# Altium project PCB_Project2.PrjPCB
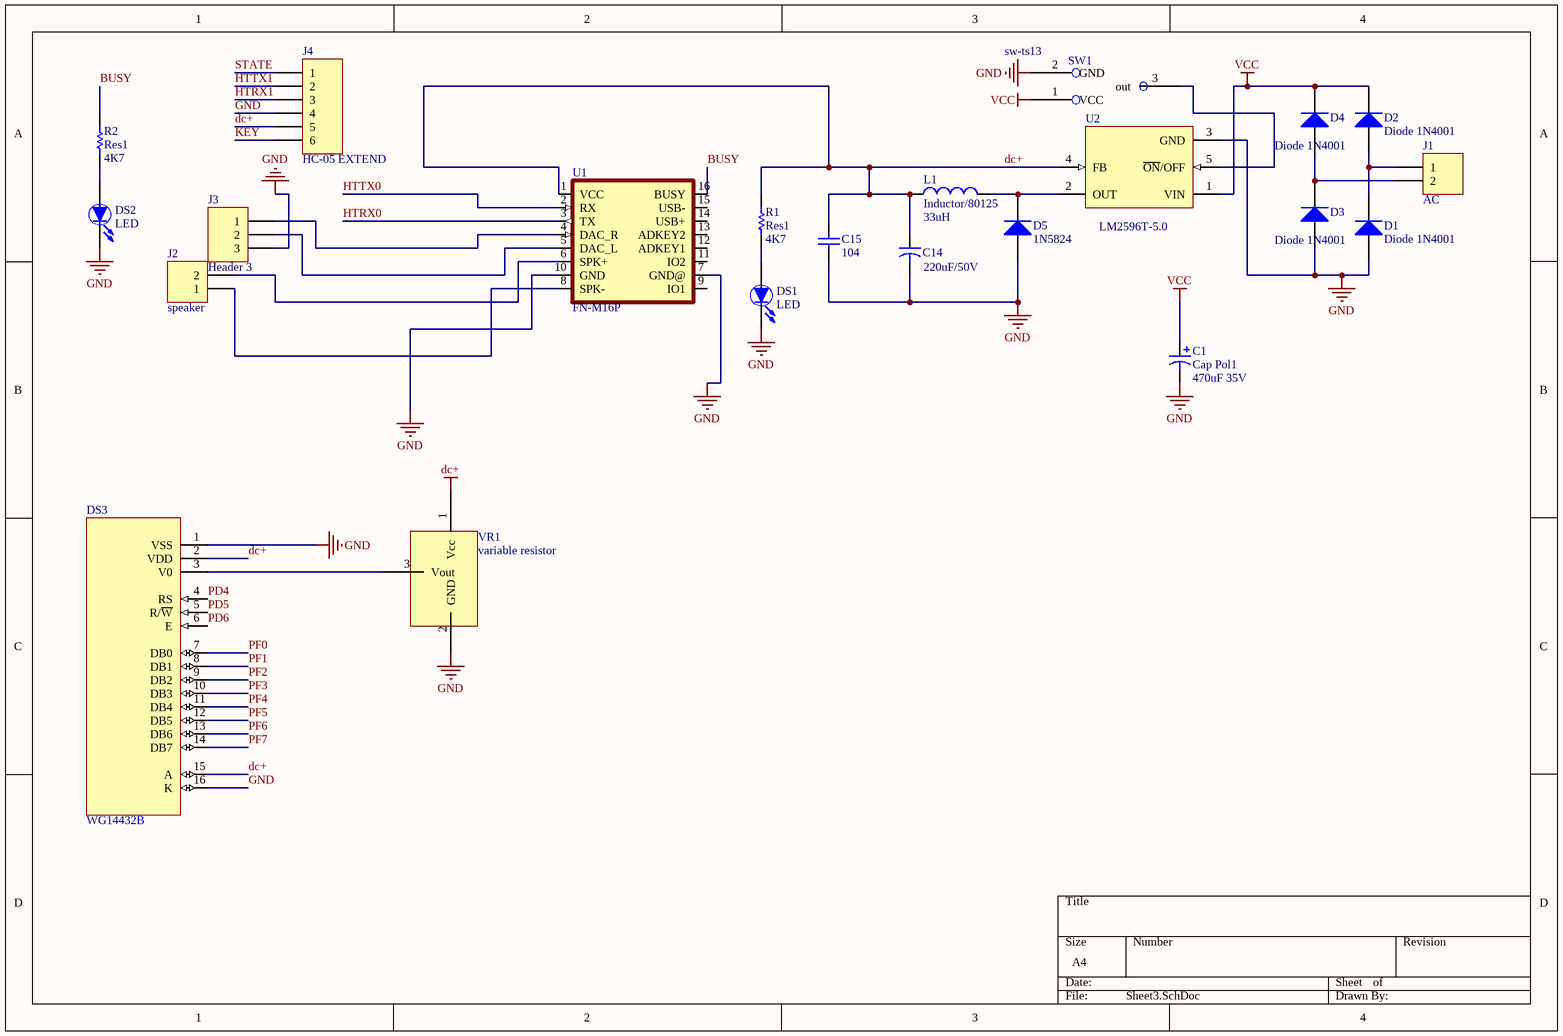
[diagram p0: Sheet3.SchDoc]
2 sheets, 40 parts. Net scope: global (net labels, ports and power ports of the same name join across sheets).
Board file: PCB1.PcbDoc
Sheets:
  Sheet3.SchDoc
  Sheet4.SchDoc

## Sheet Sheet3.SchDoc
size A4

### Parts
(Parts that share a designator on the sheet are numbered #1, #2 ... from top to bottom, then left to right.)
C1#1  Cap Pol1  value 470uF 35V  [RB7.6-15]
C14  value 220uF/50V  [CAPR5-4X5]  (hidden comment: Cap2)
C15  104  [C200]
D1  Diode 1N4001  [DO-41]
D2  Diode 1N4001  [DO-41]
D3  Diode 1N4001  [DO-41]
D4  Diode 1N4001  [DO-41]
D5  1N5824  [DO-201AD]
DS1  LED  [LED-3mm_G]
DS2  LED  [LED-3mm_G]
DS3  WG14432B  [LCM_16]
J1  AC  [HDR1X2]
J2  speaker  [HDR1X2]
J3  Header 3  [HDR1X3]
J4  HC-05 EXTEND  [HDR1X6]
L1  Inductor/80125  value 33uH  [T080125]
R1  Res1  value 4K7  [AXIAL-0.3]
R2  Res1  value 4K7  [AXIAL-0.3]
SW1  sw-ts13  [TS-13]
U1  FN-M16P  [FN-M16P]
U2  LM2596T-5.0  [T05D]
VR1  variable resistor  [var_test]

### Nets
dc+: C14.1 C15.2 DS3.2(VDD) DS3.15(A) J4.5 L1.1 R1.2 U1.1(VCC) U2.4(FB) VR1.1(Vcc)
GND: C1#1.2 C14.2 C15.1 D1.1(A) D3.1(A) D5.1(A) DS1.2(K) DS2.2(K) DS3.1(VSS) DS3.16(K) J3.3 J4.4 SW1.2(GND) U1.7(GND@) U1.10(GND) U2.3(GND) VR1.2(GND)
VCC: C1#1.1 D2.2(K) D4.2(K) SW1.1(VCC) U2.1(VIN)
BUSY: R2.2 U1.16(BUSY)
HTRX0: U1.3(TX)
HTRX1: J4.3
HTTX0: U1.2(RX)
HTTX1: J4.2
KEY: J4.6
PD4: DS3.4(RS)
PD5: DS3.5(R/~{W})
PD6: DS3.6(E)
PF0: DS3.7(DB0)
PF1: DS3.8(DB1)
PF2: DS3.9(DB2)
PF3: DS3.10(DB3)
PF4: DS3.11(DB4)
PF5: DS3.12(DB5)
PF6: DS3.13(DB6)
PF7: DS3.14(DB7)
STATE: J4.1
NetD1_2: D1.2(K) D2.1(A) J1.1
NetD3_2: D3.2(K) D4.1(A) J1.2
NetD5_2: D5.2(K) L1.2 U2.2(OUT)
NetDS1_1: DS1.1(A) R1.1
NetDS2_1: DS2.1(A) R2.1
NetDS3_3: DS3.3(V0) VR1.3(Vout)
NetJ2_1: J2.1 U1.8(SPK-)
NetJ2_2: J2.2 U1.6(SPK+)
NetJ3_1: J3.1 U1.4(DAC_R)
NetJ3_2: J3.2 U1.5(DAC_L)
NetSW1_3: SW1.3(out) U2.5(~{ON}/OFF)

Not connected (* = marked no-connect by the designer): U1 9(IO1) 11(IO2) 12(ADKEY1) 13(ADKEY2) 14(USB+) 15(USB-)

### Library data of the parts
C1#1 = Cap Pol1: Polarized Capacitor (Radial); Published: 8-Jun-2000; LatestRevisionDate: 17-Jul-2002; LatestRevisionNote: Re-released for DXP Platform.; PackageReference: RB7.6-15; Publisher: Altium Limited; PackageDescription: Polarized Capacitor (Radial); 2 Leads
C14 = Cap2: Capacitor; Published: 23-Sep-2002; PackageReference: CAPR5-4X5; Publisher: Altium Limited; PackageDescription: Capacitor; 2 Leads
C15 = Cap: Capacitor; Published: 8-Jun-2000; LatestRevisionDate: 17-Jul-2002; LatestRevisionNote: Re-released for DXP Platform.; PackageReference: RAD-0.3; Publisher: Altium Limited
D1-D4 = Diode 1N4001: 1 Amp General Purpose Rectifier; Published: 8-Jun-2000; LatestRevisionDate: 17-Jul-2002; LatestRevisionNote: Re-released for DXP Platform.; DatasheetVersion: 1998; PackageVersion: Aug-1999; PackageReference: DO-41; Publisher: Altium Limited; PackageDescription: Diode, Axial; Body 5.2 x 2.7 mm (LxDia. max), Lead Dia. 0.86 mm (max); Code_JEDEC: DO-204-AL; ComponentLink1Description: Manufacturer Link; ComponentLink1URL: http://www.fairchildsemi.com/; ComponentLink2Description: Datasheet; ComponentLink2URL: http://www.fairchildsemi.com/ds/1N%2F1N4001.pdf
D5 = Diode 1N5408: 3 Amp Medium Power Silicon Rectifier Diode; Published: 8-Jun-2000; LatestRevisionDate: 17-Jul-2002; LatestRevisionNote: Re-released for DXP Platform.; DatasheetVersion: Aug-1984; PackageReference: DO-201AD; Publisher: Altium Limited; PackageDescription: Diode, Axial; Body 9.5 x 5.3 mm (LxDia. max), Lead Dia. 1.32 mm (max); ComponentLink1Description: Manufacturer Link; ComponentLink1URL: http://www.irf.com/
DS1 DS2 = LED: Typical INFRARED GaAs LED; Published: 8-Jun-2000; LatestRevisionDate: 08-Jul-2005; LatestRevisionNote: Mech Layer 1 removed.; PackageReference: LED-0; Publisher: Altium Limited
DS3 = WG14432B: LCD Module
J1 J2 = Header 2: Header, 2-Pin; LatestRevisionDate: 17-Jul-2002; LatestRevisionNote: Re-released for DXP Platform.; Publisher: Altium Limited
J3 = Header 3: Header, 3-Pin; LatestRevisionDate: 17-Jul-2002; LatestRevisionNote: Re-released for DXP Platform.; Publisher: Altium Limited
J4 = Header 6: Header, 6-Pin; LatestRevisionDate: 17-Jul-2002; LatestRevisionNote: Re-released for DXP Platform.; Publisher: Altium Limited
L1 = Inductor: Code_IEC: 1005; Published: 8-Jun-2000; LatestRevisionDate: 29-May-2009; LatestRevisionNote: IPC-7351 Footprint Added.; PackageReference: 0402-A; Publisher: Altium Limited; PackageDescription: Chip Inductor; Code_JEITA: 0402
R1 R2 = Res1: Resistor; Published: 8-Jun-2000; LatestRevisionDate: 17-Jul-2002; LatestRevisionNote: Re-released for DXP Platform.; PackageReference: AXIAL-0.3; Publisher: Altium Limited; PackageDescription: Axial Device, Thru-Hole; 2 Leads; 0.3 in Pin Spacing
U1 = FN-M16P: Embedded MP3 Audio Module; MF: Flyron Technology Co., Ltd.; SnapEDA_Link: https://www.snapeda.com/parts/FN-M16P/Flyron+Technology+Co.%252C+Ltd./view-part/?ref=snap; Package: Package; Price: None; MP: FN-M16P; Availability: Not in stock; Value: *; Check_prices: https://www.snapeda.com/parts/FN-M16P/Flyron+Technology+Co.%252C+Ltd./view-part/?ref=eda
U2 = LM2596T-5.0: SIMPLE SWITCHER?Power Converter 150 KHz 3A Step-Down Voltage Regulator, 5-pin TO-220; Manufacturer: National Semiconductor; PackageTopMarking: NSUZXYTTE#*LM2596T*-5.0 P+; PowerWise: N; Published: 4-Dec-2008; DatasheetVersion: May-2002; PackageVersion: revA, Oct-1989; PackageReference: T05D; Publisher: Altium Limited; PackageDescription: TO-220, Molded, Stagger Bend, 5 Lead; Supplier 1: Farnell; Supplier Part Number 1: 1206529; PartNumber: LM2596T-5.0; RoHS: N; PinCount: 5; CompType: Switcher; ComponentLink1Description: LM2596 Datasheet; ComponentLink1URL: http://www.national.com/ds/LM/LM2596.pdf; ComponentLink2Description: LM2596 Web Page; ComponentLink2URL: http://www.national.com/pf/LM/LM2596.html; ComponentLink3Description: T05D Package Page; ComponentLink3URL: http://www.national.com/packaging/folders/t05d.html

## Sheet Sheet4.SchDoc
size A4
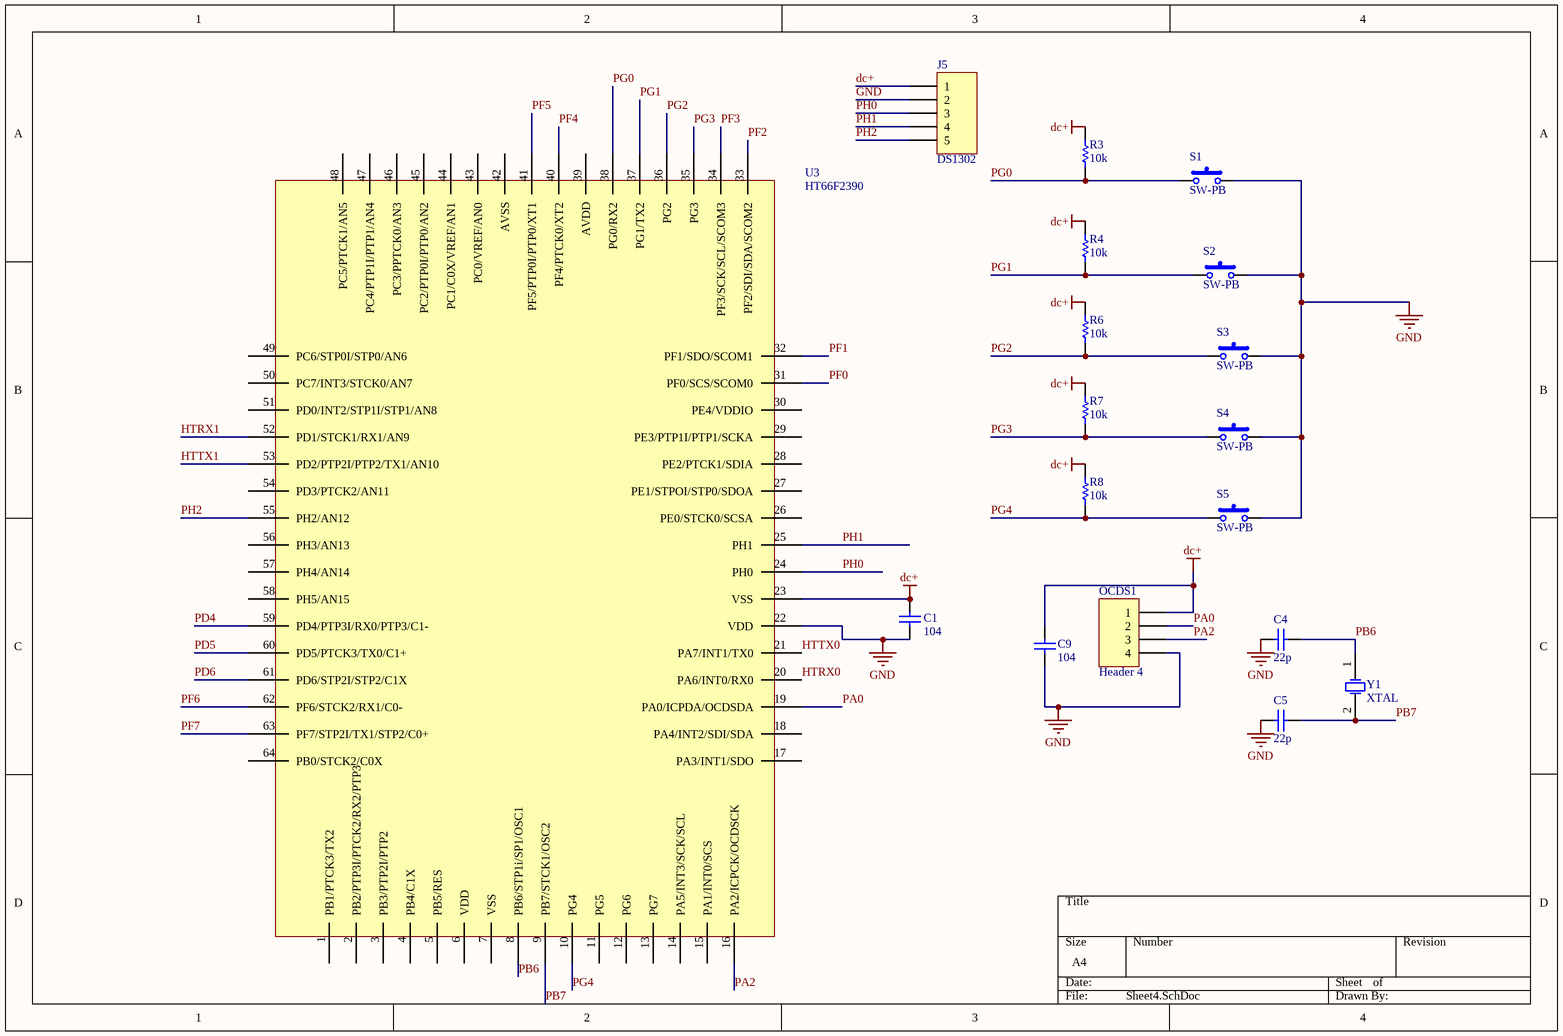
[diagram p1: Sheet4.SchDoc]

### Parts
(Parts that share a designator on the sheet are numbered #1, #2 ... from top to bottom, then left to right.)
C1#2  104  [C200]
C4  22p  [C200]
C5  22p  [C200]
C9  104  [C200]
J5  DS1302  [HDR1X5]
OCDS1  Header 4  [HDR1X4]
R3  10k  [AXIAL-0.3]
R4  10k  [AXIAL-0.3]
R6  10k  [AXIAL-0.3]
R7  10k  [AXIAL-0.3]
R8  10k  [AXIAL-0.3]
S1  SW-PB  [TACK6]
S2  SW-PB  [TACK6]
S3  SW-PB  [TACK6]
S4  SW-PB  [TACK6]
S5  SW-PB  [TACK6]
U3  HT66F2390  [LFPQ-64]
Y1  XTAL  [XTAL4-8]

### Nets
dc+: C1#2.2 C9.2 J5.1 OCDS1.1 R3.2 R4.1 R6.1 R7.1 R8.1 U3.23(VSS)
GND: C1#2.1 C4.1 C5.1 C9.1 J5.2 OCDS1.4 S1.2 S2.2 S3.2 S4.2 S5.2 U3.22(VDD)
HTRX0: U3.20(PA6/INT0/RX0)
HTRX1: U3.52(PD1/STCK1/RX1/AN9)
HTTX0: U3.21(PA7/INT1/TX0)
HTTX1: U3.53(PD2/PTP2I/PTP2/TX1/AN10)
PA0: OCDS1.2 U3.19(PA0/ICPDA/OCDSDA)
PA2: OCDS1.3 U3.16(PA2/ICPCK/OCDSCK)
PB6: C4.2 U3.8(PB6/STP1i/SP1/OSC1) Y1.1(OSC1)
PB7: C5.2 U3.9(PB7/STCK1/OSC2) Y1.2(OSC2)
PD4: U3.59(PD4/PTP3I/RX0/PTP3/C1-)
PD5: U3.60(PD5/PTCK3/TX0/C1+)
PD6: U3.61(PD6/STP2I/STP2/C1X)
PF0: U3.31(PF0/SCS/SCOM0)
PF1: U3.32(PF1/SDO/SCOM1)
PF2: U3.33(PF2/SDI/SDA/SCOM2)
PF3: U3.34(PF3/SCK/SCL/SCOM3)
PF4: U3.40(PF4/PTCK0/XT2)
PF5: U3.41(PF5/PTP0I/PTP0/XT1)
PF6: U3.62(PF6/STCK2/RX1/C0-)
PF7: U3.63(PF7/STP2I/TX1/STP2/C0+)
PG0: R3.1 S1.1 U3.38(PG0/RX2)
PG1: R4.2 S2.1 U3.37(PG1/TX2)
PG2: R6.2 S3.1 U3.36(PG2)
PG3: R7.2 S4.1 U3.35(PG3)
PG4: R8.2 S5.1 U3.10(PG4)
PH0: J5.3 U3.24(PH0)
PH1: J5.4 U3.25(PH1)
PH2: J5.5 U3.55(PH2/AN12)

Not connected (* = marked no-connect by the designer): U3 1(PB1/PTCK3/TX2) 2(PB2/PTP3I/PTCK2/RX2/PTP3) 3(PB3/PTP2I/PTP2) 4(PB4/C1X) 5(PB5/RES) 6(VDD) 7(VSS) 11(PG5) 12(PG6) 13(PG7) 14(PA5/INT3/SCK/SCL) 15(PA1/INT0/SCS) 17(PA3/INT1/SDO) 18(PA4/INT2/SDI/SDA) 26(PE0/STCK0/SCSA) 27(PE1/STPOI/STP0/SDOA) 28(PE2/PTCK1/SDIA) 29(PE3/PTP1I/PTP1/SCKA) 30(PE4/VDDIO) 39(AVDD) 42(AVSS) 43(PC0/VREF/AN0) 44(PC1/C0X/VREF/AN1) 45(PC2/PTP0I/PTP0/AN2) 46(PC3/PPTCK0/AN3) 47(PC4/PTP1I/PTP1/AN4) 48(PC5/PTCK1/AN5) 49(PC6/STP0I/STP0/AN6) 50(PC7/INT3/STCK0/AN7) 51(PD0/INT2/STP1I/STP1/AN8) 54(PD3/PTCK2/AN11) 56(PH3/AN13) 57(PH4/AN14) 58(PH5/AN15) 64(PB0/STCK2/C0X)

### Library data of the parts
C1#2 C4 C5 C9 = Cap: Capacitor; Published: 8-Jun-2000; LatestRevisionDate: 17-Jul-2002; LatestRevisionNote: Re-released for DXP Platform.; PackageReference: RAD-0.3; Publisher: Altium Limited
J5 = Header 5: Header, 5-Pin; LatestRevisionDate: 17-Jul-2002; LatestRevisionNote: Re-released for DXP Platform.; Publisher: Altium Limited
OCDS1 = Header 4: Header, 4-Pin; LatestRevisionDate: 17-Jul-2002; LatestRevisionNote: Re-released for DXP Platform.; Publisher: Altium Limited
R3 R4 R6-R8 = Res: Resistor; Published: 8-Jun-2000; LatestRevisionDate: 17-Jul-2002; LatestRevisionNote: Re-released for DXP Platform.; PackageReference: AXIAL-0.3; Publisher: Altium Limited
S1-S5 = SW-PB: Switch; Published: 24-Mar-1999; LatestRevisionDate: 17-Jul-2002; LatestRevisionNote: Re-released for DXP Platform.; PackageReference: SPST-2; Publisher: Altium Limited
Y1 = XTAL: Crystal Oscillator; Published: 8-Jun-2000; LatestRevisionDate: 17-Jul-2002; LatestRevisionNote: Re-released for DXP Platform.; PackageReference: R38; Publisher: Altium Limited

## Nets that join several sheets
dc+: Sheet3 (10 pins), Sheet4 (10 pins)
GND: Sheet3 (17 pins), Sheet4 (12 pins)
HTRX0: Sheet3 (U1.3), Sheet4 (U3.20)
HTRX1: Sheet3 (J4.3), Sheet4 (U3.52)
HTTX0: Sheet3 (U1.2), Sheet4 (U3.21)
HTTX1: Sheet3 (J4.2), Sheet4 (U3.53)
PD4: Sheet3 (DS3.4), Sheet4 (U3.59)
PD5: Sheet3 (DS3.5), Sheet4 (U3.60)
PD6: Sheet3 (DS3.6), Sheet4 (U3.61)
PF0: Sheet3 (DS3.7), Sheet4 (U3.31)
PF1: Sheet3 (DS3.8), Sheet4 (U3.32)
PF2: Sheet3 (DS3.9), Sheet4 (U3.33)
PF3: Sheet3 (DS3.10), Sheet4 (U3.34)
PF4: Sheet3 (DS3.11), Sheet4 (U3.40)
PF5: Sheet3 (DS3.12), Sheet4 (U3.41)
PF6: Sheet3 (DS3.13), Sheet4 (U3.62)
PF7: Sheet3 (DS3.14), Sheet4 (U3.63)